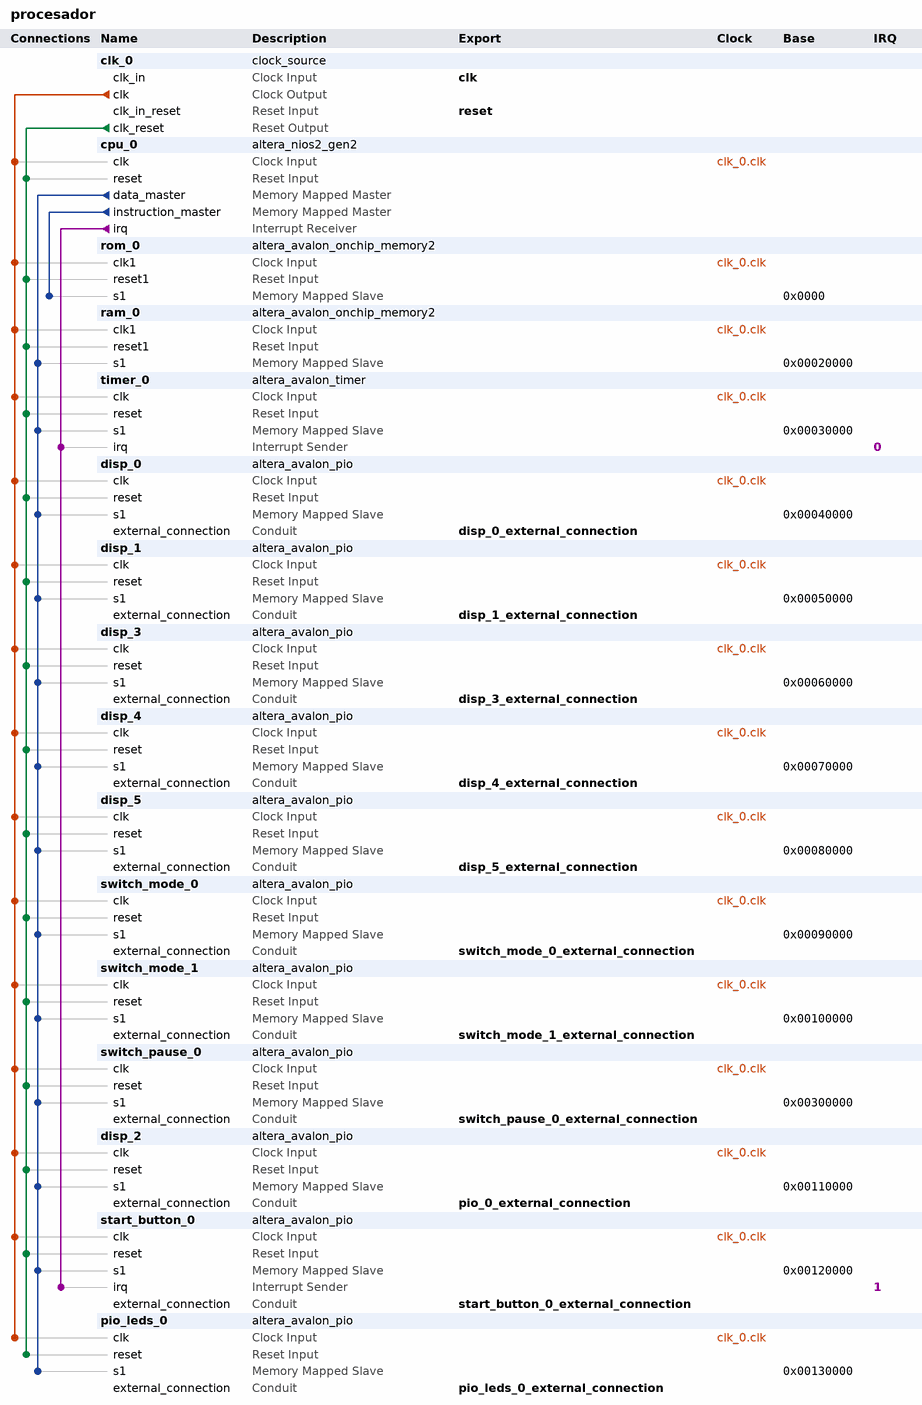
[diagram p0: system contents]
# Platform Designer (Qsys) system procesador, Cyclone V 5CSEMA5F31C6
# Parameters at their usual value, and those the tool derives, are not listed.
package require -exact qsys 22.1
create_system procesador
set_project_property DEVICE_FAMILY {Cyclone V}
set_project_property DEVICE 5CSEMA5F31C6

add_instance clk_0 clock_source 22.1
set_instance_parameter_value clk_0 clockFrequency 50000000

add_instance cpu_0 altera_nios2_gen2 22.1
set_instance_parameter_value cpu_0 dcache_size 2048
set_instance_parameter_value cpu_0 debug_enabled false
set_instance_parameter_value cpu_0 exceptionSlave rom_0.s1
set_instance_parameter_value cpu_0 icache_size 4096
set_instance_parameter_value cpu_0 impl Tiny
set_instance_parameter_value cpu_0 resetSlave rom_0.s1

add_instance rom_0 altera_avalon_onchip_memory2 22.1
set_instance_parameter_value rom_0 dataWidth 32
set_instance_parameter_value rom_0 dualPort false
set_instance_parameter_value rom_0 initMemContent true
set_instance_parameter_value rom_0 initializationFileName onchip_mem.hex
set_instance_parameter_value rom_0 memorySize 8192
set_instance_parameter_value rom_0 writable false

add_instance ram_0 altera_avalon_onchip_memory2 22.1
set_instance_parameter_value ram_0 dataWidth 32
set_instance_parameter_value ram_0 dualPort false
set_instance_parameter_value ram_0 initMemContent true
set_instance_parameter_value ram_0 initializationFileName onchip_mem.hex
set_instance_parameter_value ram_0 memorySize 8192

add_instance timer_0 altera_avalon_timer 22.1
set_instance_parameter_value timer_0 alwaysRun true
set_instance_parameter_value timer_0 fixedPeriod true
set_instance_parameter_value timer_0 period 1
set_instance_parameter_value timer_0 periodUnits MSEC
set_instance_parameter_value timer_0 snapshot false

add_instance disp_0 altera_avalon_pio 22.1
set_instance_parameter_value disp_0 direction Output
set_instance_parameter_value disp_0 width 7

add_instance disp_1 altera_avalon_pio 22.1
set_instance_parameter_value disp_1 direction Output
set_instance_parameter_value disp_1 width 7

add_instance disp_3 altera_avalon_pio 22.1
set_instance_parameter_value disp_3 direction Output
set_instance_parameter_value disp_3 width 7

add_instance disp_4 altera_avalon_pio 22.1
set_instance_parameter_value disp_4 direction Output
set_instance_parameter_value disp_4 width 7

add_instance disp_5 altera_avalon_pio 22.1
set_instance_parameter_value disp_5 direction Output
set_instance_parameter_value disp_5 width 7

add_instance switch_mode_0 altera_avalon_pio 22.1
set_instance_parameter_value switch_mode_0 direction Input
set_instance_parameter_value switch_mode_0 width 1

add_instance switch_mode_1 altera_avalon_pio 22.1
set_instance_parameter_value switch_mode_1 direction Input
set_instance_parameter_value switch_mode_1 width 1

add_instance switch_pause_0 altera_avalon_pio 22.1
set_instance_parameter_value switch_pause_0 direction Input
set_instance_parameter_value switch_pause_0 width 1

add_instance disp_2 altera_avalon_pio 22.1
set_instance_parameter_value disp_2 direction Output
set_instance_parameter_value disp_2 width 7

add_instance start_button_0 altera_avalon_pio 22.1
set_instance_parameter_value start_button_0 captureEdge true
set_instance_parameter_value start_button_0 direction Input
set_instance_parameter_value start_button_0 edgeType FALLING
set_instance_parameter_value start_button_0 generateIRQ true
set_instance_parameter_value start_button_0 irqType EDGE
set_instance_parameter_value start_button_0 width 1

add_instance pio_leds_0 altera_avalon_pio 22.1
set_instance_parameter_value pio_leds_0 direction Output
set_instance_parameter_value pio_leds_0 width 3

# connections
add_connection clk_0.clk cpu_0.clk clock
add_connection clk_0.clk disp_0.clk clock
add_connection clk_0.clk disp_1.clk clock
add_connection clk_0.clk disp_2.clk clock
add_connection clk_0.clk disp_3.clk clock
add_connection clk_0.clk disp_4.clk clock
add_connection clk_0.clk disp_5.clk clock
add_connection clk_0.clk pio_leds_0.clk clock
add_connection clk_0.clk ram_0.clk1 clock
add_connection clk_0.clk rom_0.clk1 clock
add_connection clk_0.clk start_button_0.clk clock
add_connection clk_0.clk switch_mode_0.clk clock
add_connection clk_0.clk switch_mode_1.clk clock
add_connection clk_0.clk switch_pause_0.clk clock
add_connection clk_0.clk timer_0.clk clock
add_connection clk_0.clk_reset cpu_0.reset reset
add_connection clk_0.clk_reset disp_0.reset reset
add_connection clk_0.clk_reset disp_1.reset reset
add_connection clk_0.clk_reset disp_2.reset reset
add_connection clk_0.clk_reset disp_3.reset reset
add_connection clk_0.clk_reset disp_4.reset reset
add_connection clk_0.clk_reset disp_5.reset reset
add_connection clk_0.clk_reset pio_leds_0.reset reset
add_connection clk_0.clk_reset ram_0.reset1 reset
add_connection clk_0.clk_reset rom_0.reset1 reset
add_connection clk_0.clk_reset start_button_0.reset reset
add_connection clk_0.clk_reset switch_mode_0.reset reset
add_connection clk_0.clk_reset switch_mode_1.reset reset
add_connection clk_0.clk_reset switch_pause_0.reset reset
add_connection clk_0.clk_reset timer_0.reset reset
add_connection cpu_0.data_master disp_0.s1 avalon
set_connection_parameter_value cpu_0.data_master/disp_0.s1 baseAddress 0x00040000
add_connection cpu_0.data_master disp_1.s1 avalon
set_connection_parameter_value cpu_0.data_master/disp_1.s1 baseAddress 0x00050000
add_connection cpu_0.data_master disp_2.s1 avalon
set_connection_parameter_value cpu_0.data_master/disp_2.s1 baseAddress 0x00110000
add_connection cpu_0.data_master disp_3.s1 avalon
set_connection_parameter_value cpu_0.data_master/disp_3.s1 baseAddress 0x00060000
add_connection cpu_0.data_master disp_4.s1 avalon
set_connection_parameter_value cpu_0.data_master/disp_4.s1 baseAddress 0x00070000
add_connection cpu_0.data_master disp_5.s1 avalon
set_connection_parameter_value cpu_0.data_master/disp_5.s1 baseAddress 0x00080000
add_connection cpu_0.data_master pio_leds_0.s1 avalon
set_connection_parameter_value cpu_0.data_master/pio_leds_0.s1 baseAddress 0x00130000
add_connection cpu_0.data_master ram_0.s1 avalon
set_connection_parameter_value cpu_0.data_master/ram_0.s1 baseAddress 0x00020000
add_connection cpu_0.data_master start_button_0.s1 avalon
set_connection_parameter_value cpu_0.data_master/start_button_0.s1 baseAddress 0x00120000
add_connection cpu_0.data_master switch_mode_0.s1 avalon
set_connection_parameter_value cpu_0.data_master/switch_mode_0.s1 baseAddress 0x00090000
add_connection cpu_0.data_master switch_mode_1.s1 avalon
set_connection_parameter_value cpu_0.data_master/switch_mode_1.s1 baseAddress 0x00100000
add_connection cpu_0.data_master switch_pause_0.s1 avalon
set_connection_parameter_value cpu_0.data_master/switch_pause_0.s1 baseAddress 0x00300000
add_connection cpu_0.data_master timer_0.s1 avalon
set_connection_parameter_value cpu_0.data_master/timer_0.s1 baseAddress 0x00030000
add_connection cpu_0.instruction_master rom_0.s1 avalon
set_connection_parameter_value cpu_0.instruction_master/rom_0.s1 baseAddress 0x0000
add_connection cpu_0.irq start_button_0.irq interrupt
set_connection_parameter_value cpu_0.irq/start_button_0.irq irqNumber 1
add_connection cpu_0.irq timer_0.irq interrupt
set_connection_parameter_value cpu_0.irq/timer_0.irq irqNumber 0

# exported interfaces
add_interface clk clock sink
set_interface_property clk EXPORT_OF clk_0.clk_in
add_interface disp_0_external_connection conduit end
set_interface_property disp_0_external_connection EXPORT_OF disp_0.external_connection
add_interface disp_1_external_connection conduit end
set_interface_property disp_1_external_connection EXPORT_OF disp_1.external_connection
add_interface disp_3_external_connection conduit end
set_interface_property disp_3_external_connection EXPORT_OF disp_3.external_connection
add_interface disp_4_external_connection conduit end
set_interface_property disp_4_external_connection EXPORT_OF disp_4.external_connection
add_interface disp_5_external_connection conduit end
set_interface_property disp_5_external_connection EXPORT_OF disp_5.external_connection
add_interface pio_0_external_connection conduit end
set_interface_property pio_0_external_connection EXPORT_OF disp_2.external_connection
add_interface pio_leds_0_external_connection conduit end
set_interface_property pio_leds_0_external_connection EXPORT_OF pio_leds_0.external_connection
add_interface reset reset sink
set_interface_property reset EXPORT_OF clk_0.clk_in_reset
add_interface start_button_0_external_connection conduit end
set_interface_property start_button_0_external_connection EXPORT_OF start_button_0.external_connection
add_interface switch_mode_0_external_connection conduit end
set_interface_property switch_mode_0_external_connection EXPORT_OF switch_mode_0.external_connection
add_interface switch_mode_1_external_connection conduit end
set_interface_property switch_mode_1_external_connection EXPORT_OF switch_mode_1.external_connection
add_interface switch_pause_0_external_connection conduit end
set_interface_property switch_pause_0_external_connection EXPORT_OF switch_pause_0.external_connection

set_interconnect_requirement {$system} qsys_mm.clockCrossingAdapter HANDSHAKE
set_interconnect_requirement {$system} qsys_mm.enableEccProtection FALSE
set_interconnect_requirement {$system} qsys_mm.insertDefaultSlave FALSE
set_interconnect_requirement {$system} qsys_mm.maxAdditionalLatency 1

save_system procesador.qsys
